# Altium schematic sheet MatrixSCH.SchDoc
size A4
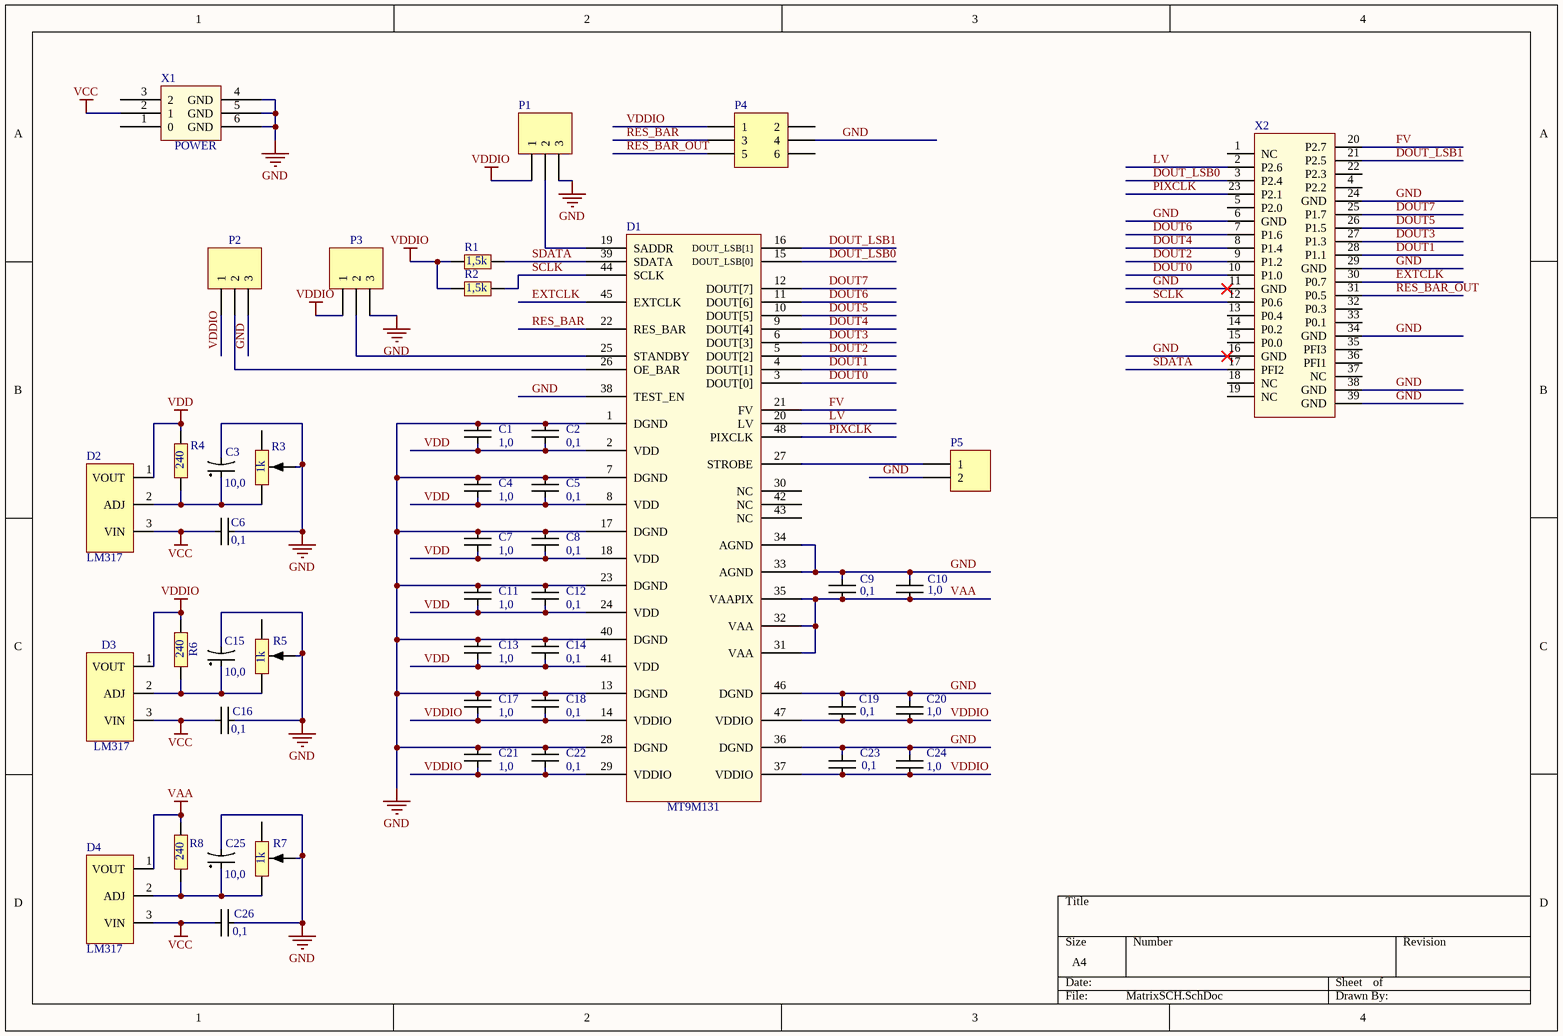
[diagram p0: MatrixSCH.SchDoc]

## Parts
C1  1,0  [CAP_SMALL]
C2  0,1  [CAP_SMALL]
C3  10,0  [TYPE_C]
C4  1,0  [CAP_SMALL]
C5  0,1  [CAP_SMALL]
C6  0,1  [CAP_SMALL]
C7  1,0  [CAP_SMALL]
C8  0,1  [CAP_SMALL]
C9  0,1  [CAP_SMALL]
C10  1,0  [CAP_SMALL]
C11  1,0  [CAP_SMALL]
C12  0,1  [CAP_SMALL]
C13  1,0  [CAP_SMALL]
C14  0,1  [CAP_SMALL]
C15  10,0  [TYPE_C]
C16  0,1  [CAP_SMALL]
C17  1,0  [CAP_SMALL]
C18  0,1  [CAP_SMALL]
C19  0,1  [CAP_SMALL]
C20  1,0  [CAP_SMALL]
C21  1,0  [CAP_SMALL]
C22  0,1  [CAP_SMALL]
C23  0,1  [CAP_SMALL]
C24  1,0  [CAP_SMALL]
C25  10,0  [TYPE_C]
C26  0,1  [CAP_SMALL]
D1  MT9M131  [LCC48]
D2  LM317  [D2PACK]
D3  LM317  [D2PACK]
D4  LM317  [D2PACK]
P1  Header 3  [HDR1X3]  (value not drawn)
P2  Header 3  [HDR1X3]  (value not drawn)
P3  Header 3  [HDR1X3]  (value not drawn)
P4  Header 3X2  [HDR2X3]  (value not drawn)
P5  Header 2  [HDR1X2]  (value not drawn)
R1  1,5k  [0805]
R2  1,5k  [0805]
R3  1k  [PV36W]
R4  240  [0805]
R5  1k  [PV36W]
R6  240  [0805]
R7  1k  [PV36W]
R8  240  [0805]
X1  POWER  [POWER]
X2  D-SUB_FEMALE  [CHEAP_CONN_FEMALE]  (value not drawn)

## Nets
GND: C1.1 C2.1 C3.1 C4.1 C5.1 C6.2 C7.1 C8.1 C9.2 C10.2 C11.1 C12.1 C13.1 C14.1 C15.1 C16.2 C17.1 C18.1 C19.2 C20.2 C21.1 C22.1 C23.2 C24.2 C25.1 C26.2 D1.1(DGND) D1.7(DGND) D1.13(DGND) D1.17(DGND) D1.23(DGND) D1.28(DGND) D1.33(AGND) D1.34(AGND) D1.36(DGND) D1.38(TEST_EN) D1.40(DGND) D1.46(DGND) P1.3 P2.3 P3.3 P4.4 P5.2 R3.2 R5.2 R7.2 X1.4(GND) X1.5(GND) X1.6(GND) X2.6(GND) X2.11(GND) X2.16(GND) X2.24(GND) X2.29(GND) X2.34(GND) X2.38(GND) X2.39(GND)
VAA: C9.1 C10.1 D1.31(VAA) D1.32(VAA) D1.35(VAAPIX) D4.1(VOUT) R8.1
VCC: C6.1 C16.1 C26.1 D2.3(VIN) D3.3(VIN) D4.3(VIN) X1.2(1)
VDD: C1.2 C2.2 C4.2 C5.2 C7.2 C8.2 C11.2 C12.2 C13.2 C14.2 D1.2(VDD) D1.8(VDD) D1.18(VDD) D1.24(VDD) D1.41(VDD) D2.1(VOUT) R4.1
VDDIO: C17.2 C18.2 C19.1 C20.1 C21.2 C22.2 C23.1 C24.1 D1.14(VDDIO) D1.29(VDDIO) D1.37(VDDIO) D1.47(VDDIO) D3.1(VOUT) P1.1 P2.1 P3.1 P4.1 R1.1 R2.1 R6.1
DOUT0: D1.3(DOUT[0]) X2.10(P1.0)
DOUT1: D1.4(DOUT[1]) X2.28(P1.1)
DOUT2: D1.5(DOUT[2]) X2.9(P1.2)
DOUT3: D1.6(DOUT[3]) X2.27(P1.3)
DOUT4: D1.9(DOUT[4]) X2.8(P1.4)
DOUT5: D1.10(DOUT[5]) X2.26(P1.5)
DOUT6: D1.11(DOUT[6]) X2.7(P1.6)
DOUT7: D1.12(DOUT[7]) X2.25(P1.7)
DOUT_LSB0: D1.15(DOUT_LSB[0]) X2.3(P2.4)
DOUT_LSB1: D1.16(DOUT_LSB[1]) X2.21(P2.5)
EXTCLK: D1.45(EXTCLK) X2.30(P0.7)
FV: D1.21(FV) X2.20(P2.7)
LV: D1.20(LV) X2.2(P2.6)
PIXCLK: D1.48(PIXCLK) X2.23(P2.1)
RES_BAR: D1.22(RES_BAR) P4.3
RES_BAR_OUT: P4.5 X2.31(P0.5)
SCLK: D1.44(SCLK) R2.2 X2.12(P0.6)
SDATA: D1.39(SDATA) R1.2 X2.17(PFI2)
NetC3_2: C3.2 D2.2(ADJ) R3.1 R4.2
NetC15_2: C15.2 D3.2(ADJ) R5.1 R6.2
NetC25_2: C25.2 D4.2(ADJ) R7.1 R8.2
NetD1_19: D1.19(SADDR) P1.2
NetD1_25: D1.25(STANDBY) P3.2
NetD1_26: D1.26(OE_BAR) P2.2
NetD1_27: D1.27(STROBE) P5.1

Not connected (* = marked no-connect by the designer): D1 30(NC) 42(NC) 43(NC); P4 2 6; R3 3; R5 3; R7 3; X1 1(0) 3(2); X2 1(NC) 4(P2.2) 5(P2.0) 13(P0.4) 14(P0.2) 15(P0.0) 18(NC) 19(NC) 22(P2.3) 32(P0.3) 33(P0.1) 35(PFI3) 36(PFI1) 37(NC)

## Library data of the parts
C1 C2 C4-C14 C16-C24 C26 = CAP_SMALL: 0805
C3 C15 C25 = CAP_TANT: SMD
D1 = MT9M131: Matrix
P1-P3 = Header 3: Header, 3-Pin; LatestRevisionDate: 17-Jul-2002; LatestRevisionNote: Re-released for DXP Platform.; Publisher: Altium Limited
P4 = Header 3X2: Header, 3-Pin, Dual row; LatestRevisionDate: 17-Jul-2002; LatestRevisionNote: Re-released for DXP Platform.; Publisher: Altium Limited
P5 = Header 2: Header, 2-Pin; LatestRevisionDate: 17-Jul-2002; LatestRevisionNote: Re-released for DXP Platform.; Publisher: Altium Limited
R1 R2 R4 R6 R8 = RES0805: 0805
R3 R5 R7 = RES_VAR: PV36W102C (СП5-2ВБ) 1 кОм
X2 = CHEAP_CON_37_FEMALE